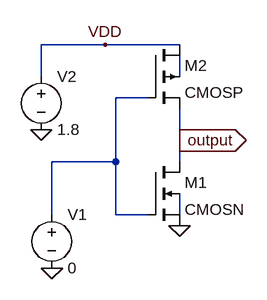
[diagram p0: schematic CMOS_dc_power_analysis.asc]
CMOS_dc_power_analysis.asc, the LTspice schematic file:
Version 4
SHEET 1 880 680

* === Power Supply ===
WIRE 192 0 96 0
WIRE 304 0 192 0
WIRE 96 48 96 0
WIRE 304 48 304 16

* === Transistor Connections ===
WIRE 256 80 208 80
WIRE 304 144 304 96
WIRE 208 176 208 80
WIRE 208 176 112 176
WIRE 304 176 304 144
WIRE 112 256 112 176
WIRE 208 256 208 176
WIRE 256 256 208 256
WIRE 304 256 304 224

* === Ground and Output ===
FLAG 304 272 0
FLAG 112 336 0
FLAG 96 128 0
FLAG 304 144 output
IOPIN 304 144 Out
FLAG 192 0 VDD

* === Voltage Sources ===
SYMBOL voltage 112 240 R0
SYMATTR InstName V1
SYMATTR Value 0
SYMBOL voltage 96 32 R0
WINDOW 123 0 0 Left 0
WINDOW 39 0 0 Left 0
SYMATTR InstName V2
SYMATTR Value 1.8

* === CMOS Transistors ===
SYMBOL cmosn 256 176 R0
SYMATTR InstName M1
SYMATTR Value2 l=180n w=400n
SYMBOL cmosp 256 0 R0
SYMATTR InstName M2
SYMATTR Value2 l=180n w=800n

* === Load SPICE Model ===
.include tsmc018.lib

* === DC Sweep Analysis ===
.DC V1 0 1.8 0.02

* === Power Measurement at Switching Points ===
.MEAS DC SCPOWER FIND V(VDD)*I(V2) AT 0.8
.MEAS DC SSPOWER FIND V(VDD)*I(V2) AT 0

The netlist it stands for:
* CMOS_dc_power_analysis.asc
V1 N002 0 0
V2 VDD 0 1.8
M1 output N002 0 N003 CMOSN l=180n w=400n
M2 VDD N002 output N001 CMOSP l=180n w=800n
.model NMOS NMOS
.model PMOS PMOS
.lib standard.mos
.backanno
.end